# Altium project Stove_pump.PrjPcb
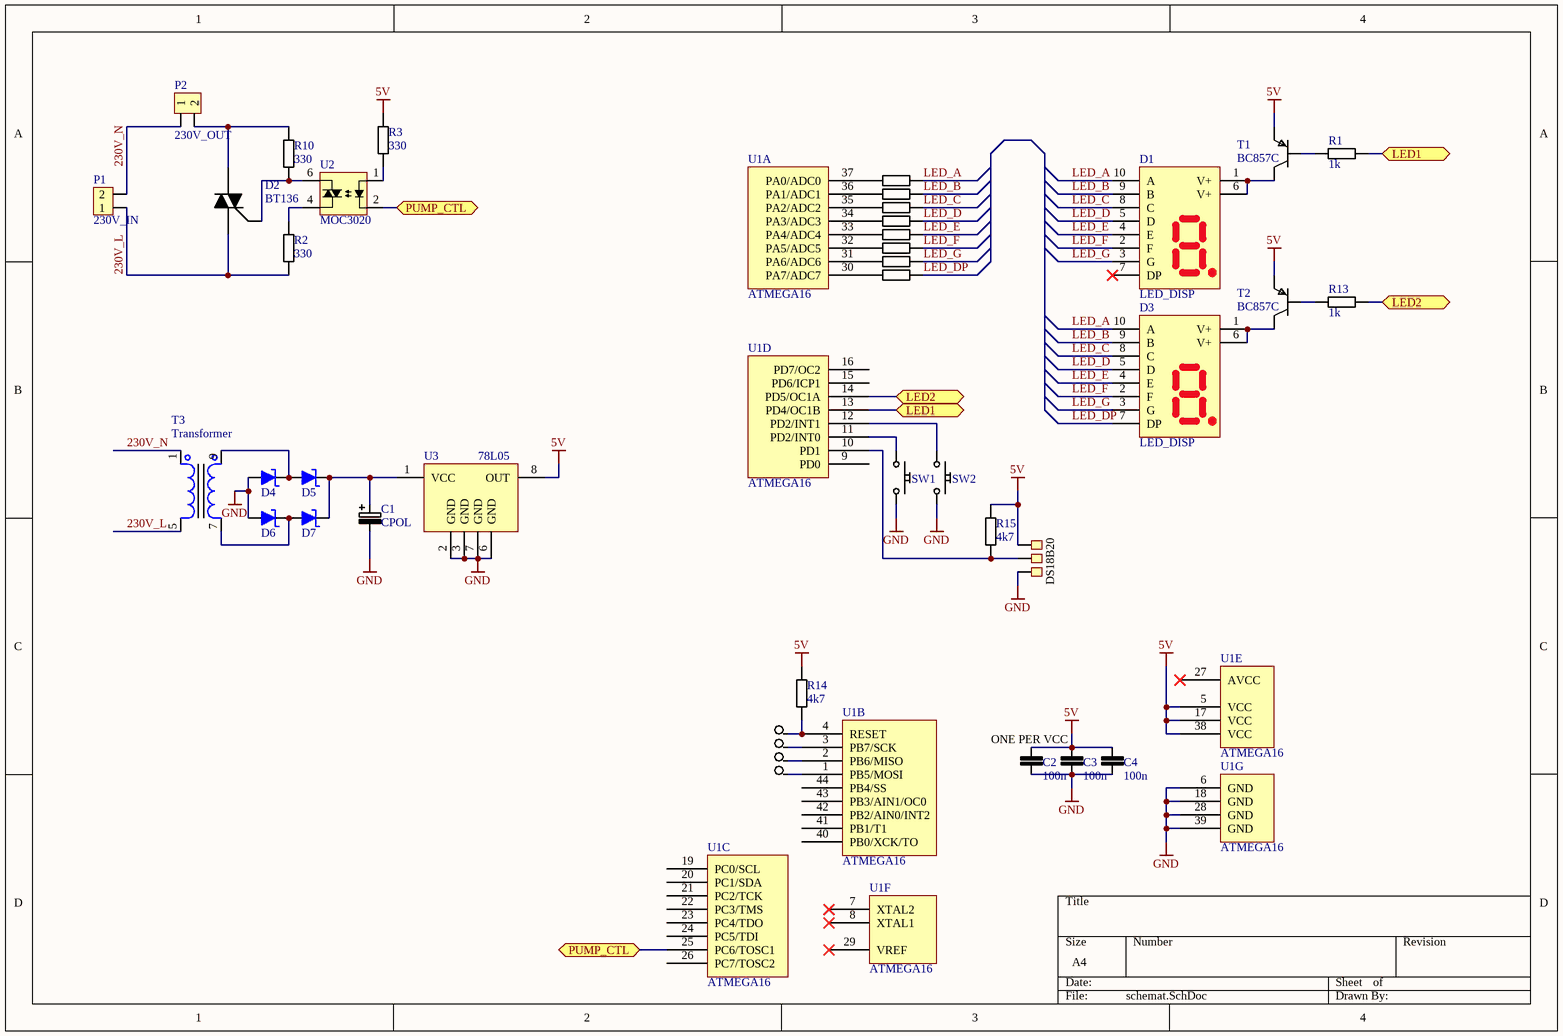
[diagram p0: schemat.SchDoc]
1 sheet, 43 parts. Net scope: flat (ports and power ports of the same name join across sheets).
Board file: pcb.PcbDoc

## Sheet schemat.SchDoc
size A4

### Parts
C1  CPOL  [Cap10/5mm]
C2  100n  [0805C]
C3  100n  [0805C]
C4  100n  [0805C]
D1  LED_DISP  [LED_DISP]
D2  BT136  [TO220]
D3  LED_DISP  [LED_DISP]
D4  Schottky  [SOD128]  (value not drawn)
D5  Schottky  [SOD128]  (value not drawn)
D6  Schottky  [SOD128]  (value not drawn)
D7  Schottky  [SOD128]  (value not drawn)
P1  230V_IN  [ARK2]
P2  230V_OUT  [ARK2]
P3  PAD  [PAD1.5]  (value not drawn)
P4  PAD  [PAD1.5]  (value not drawn)
P5  PAD  [PAD1.5]  (value not drawn)
P6  PAD  [PAD1.5]  (value not drawn)
P7  PAD_THT  [PAD_0.8mm]  (value not drawn)
P8  PAD_THT  [PAD_0.8mm]  (value not drawn)
P9  PAD_THT  [PAD_0.8mm]  (value not drawn)
R1  1k  [0805R]
R2  330  [0805R]
R3  330  [0805R]
R4  220  [0805R]  (value not drawn)
R5  220  [0805R]  (value not drawn)
R6  220  [0805R]  (value not drawn)
R7  220  [0805R]  (value not drawn)
R8  220  [0805R]  (value not drawn)
R9  220  [0805R]  (value not drawn)
R10  330  [0805R]
R11  220  [0805R]  (value not drawn)
R12  220  [0805R]  (value not drawn)
R13  1k  [0805R]
R14  4k7  [0805R]
R15  4k7  [0805R]
SW1  SW 5mm 1,5N SMD  [SW5SMD]  (value not drawn)
SW2  SW 5mm 1,5N SMD  [SW5SMD]  (value not drawn)
T1  BC857C  [SOT23-3]
T2  BC857C  [SOT23-3]
T3  Transformer  [TSZZ4.5/017M]
U1  ATMEGA16  [TQFP44]  (parts A,B,C,D,E,F,G of 7)
U2  MOC3020  [DIP6]
U3  78L05  [SOIC8]

### Ports
LED1, LED2, PUMP_CTL

### Nets
5V: C2.1 C3.1 C4.1 P7.1 R3.2 R14.1 R15.1 T1.3(C) T2.3(C) U1.5(VCC) U1.17(VCC) U1.38(VCC) U3.8(OUT)
GND: C1.1 C2.2 C3.2 C4.2 D4.2(A) D6.2(A) P9.1 SW1.1 SW2.1 U1.6(GND) U1.18(GND) U1.28(GND) U1.39(GND) U3.2(GND) U3.3(GND) U3.6(GND) U3.7(GND)
230V_L: D2.1(T1) P1.1 R2.2 T3.5
230V_N: P1.2 P2.1 T3.1
LED_A: D1.10(A) D3.10(A) R4.2
LED_B: D1.9(B) D3.9(B) R5.2
LED_C: D1.8(C) D3.8(C) R6.2
LED_D: D1.5(D) D3.5(D) R7.2
LED_DP: D3.7(DP) R12.2
LED_E: D1.4(E) D3.4(E) R8.2
LED_F: D1.2(F) D3.2(F) R9.2
LED_G: D1.3(G) D3.3(G) R11.2
NetC1_2: C1.2 D5.1(K) D7.1(K) U3.1(VCC)
NetD1_1: D1.1(V+) D1.6(V+) T1.2(E)
NetD2_2: D2.2(T2) P2.2 R10.1
NetD2_3: D2.3(G) R10.2 U2.6
NetD3_1: D3.1(V+) D3.6(V+) T2.2(E)
NetD4_1: D4.1(K) D5.2(A) T3.9
NetD6_1: D6.1(K) D7.2(A) T3.7
NetP3_1: P3.1 R14.2 U1.4(RESET)
NetP4_1: P4.1 U1.3(PB7/SCK)
NetP5_1: P5.1 U1.2(PB6/MISO)
NetP6_1: P6.1 U1.1(PB5/MOSI)
NetP8_1: P8.1 R15.2 U1.10(PD1)
NetR1_1: R1.1 T1.1(B)
NetR1_2: R1.2 U1.13(PD4/OC1B) ; port LED1
NetR2_1: R2.1 U2.4
NetR3_1: R3.1 U2.1
NetR4_1: R4.1 U1.37(PA0/ADC0)
NetR5_1: R5.1 U1.36(PA1/ADC1)
NetR6_1: R6.1 U1.35(PA2/ADC2)
NetR7_1: R7.1 U1.34(PA3/ADC3)
NetR8_1: R8.1 U1.33(PA4/ADC4)
NetR9_1: R9.1 U1.32(PA5/ADC5)
NetR11_1: R11.1 U1.31(PA6/ADC6)
NetR12_1: R12.1 U1.30(PA7/ADC7)
NetR13_1: R13.1 T2.1(B)
NetR13_2: R13.2 U1.14(PD5/OC1A) ; port LED2
NetSW1_2: SW1.2 U1.11(PD2/INT0)
NetSW2_2: SW2.2 U1.12(PD2/INT1)
NetU1_25: U1.25(PC6/TOSC1) U2.2 ; port PUMP_CTL

Not connected (* = marked no-connect by the designer): D1 7(DP)*; U1 7(XTAL2)* 8(XTAL1)* 9(PD0) 15(PD6/ICP1) 16(PD7/OC2) 19(PC0/SCL) 20(PC1/SDA) 21(PC2/TCK) 22(PC3/TMS) 23(PC4/TDO) 24(PC5/TDI) 26(PC7/TOSC2) 27(AVCC)* 29(VREF)* 40(PB0/XCK/TO) 41(PB1/T1) 42(PB2/AIN0/INT2) 43(PB3/AIN1/OC0) 44(PB4/SS)

### Notes on the sheet
- DS18B20
- ONE PER VCC

### Library data of the parts
C2-C4 = C: Kondensator; Type: Kondensator
D1 D3 = LED_DISP: Product name: JZD036106NB-BW
P1 P2 = ARK2: 5mm; Farnell: 2493622
R1-R15 = R: Rezystor; Type: Rezystor
SW1 SW2 = SW 5mm 1,5N SMD: Microswitch; Manufacturer Part Number 1: FSM4JSMA; Manufacturer 1: TE Connectivity; Supplier 1: Farnell; Supplier Part Number 1: 3801305; Type: Inne
T1 T2 = BC857C: PNP (45V/0.1A)